# Altium schematic sheet Interface_IO.SchDoc: Access Control
size A3; DrawnBy: Q.Thang & T.Khoa; Revision: V1.0.1; SheetNumber: 16; SheetTotal: 16
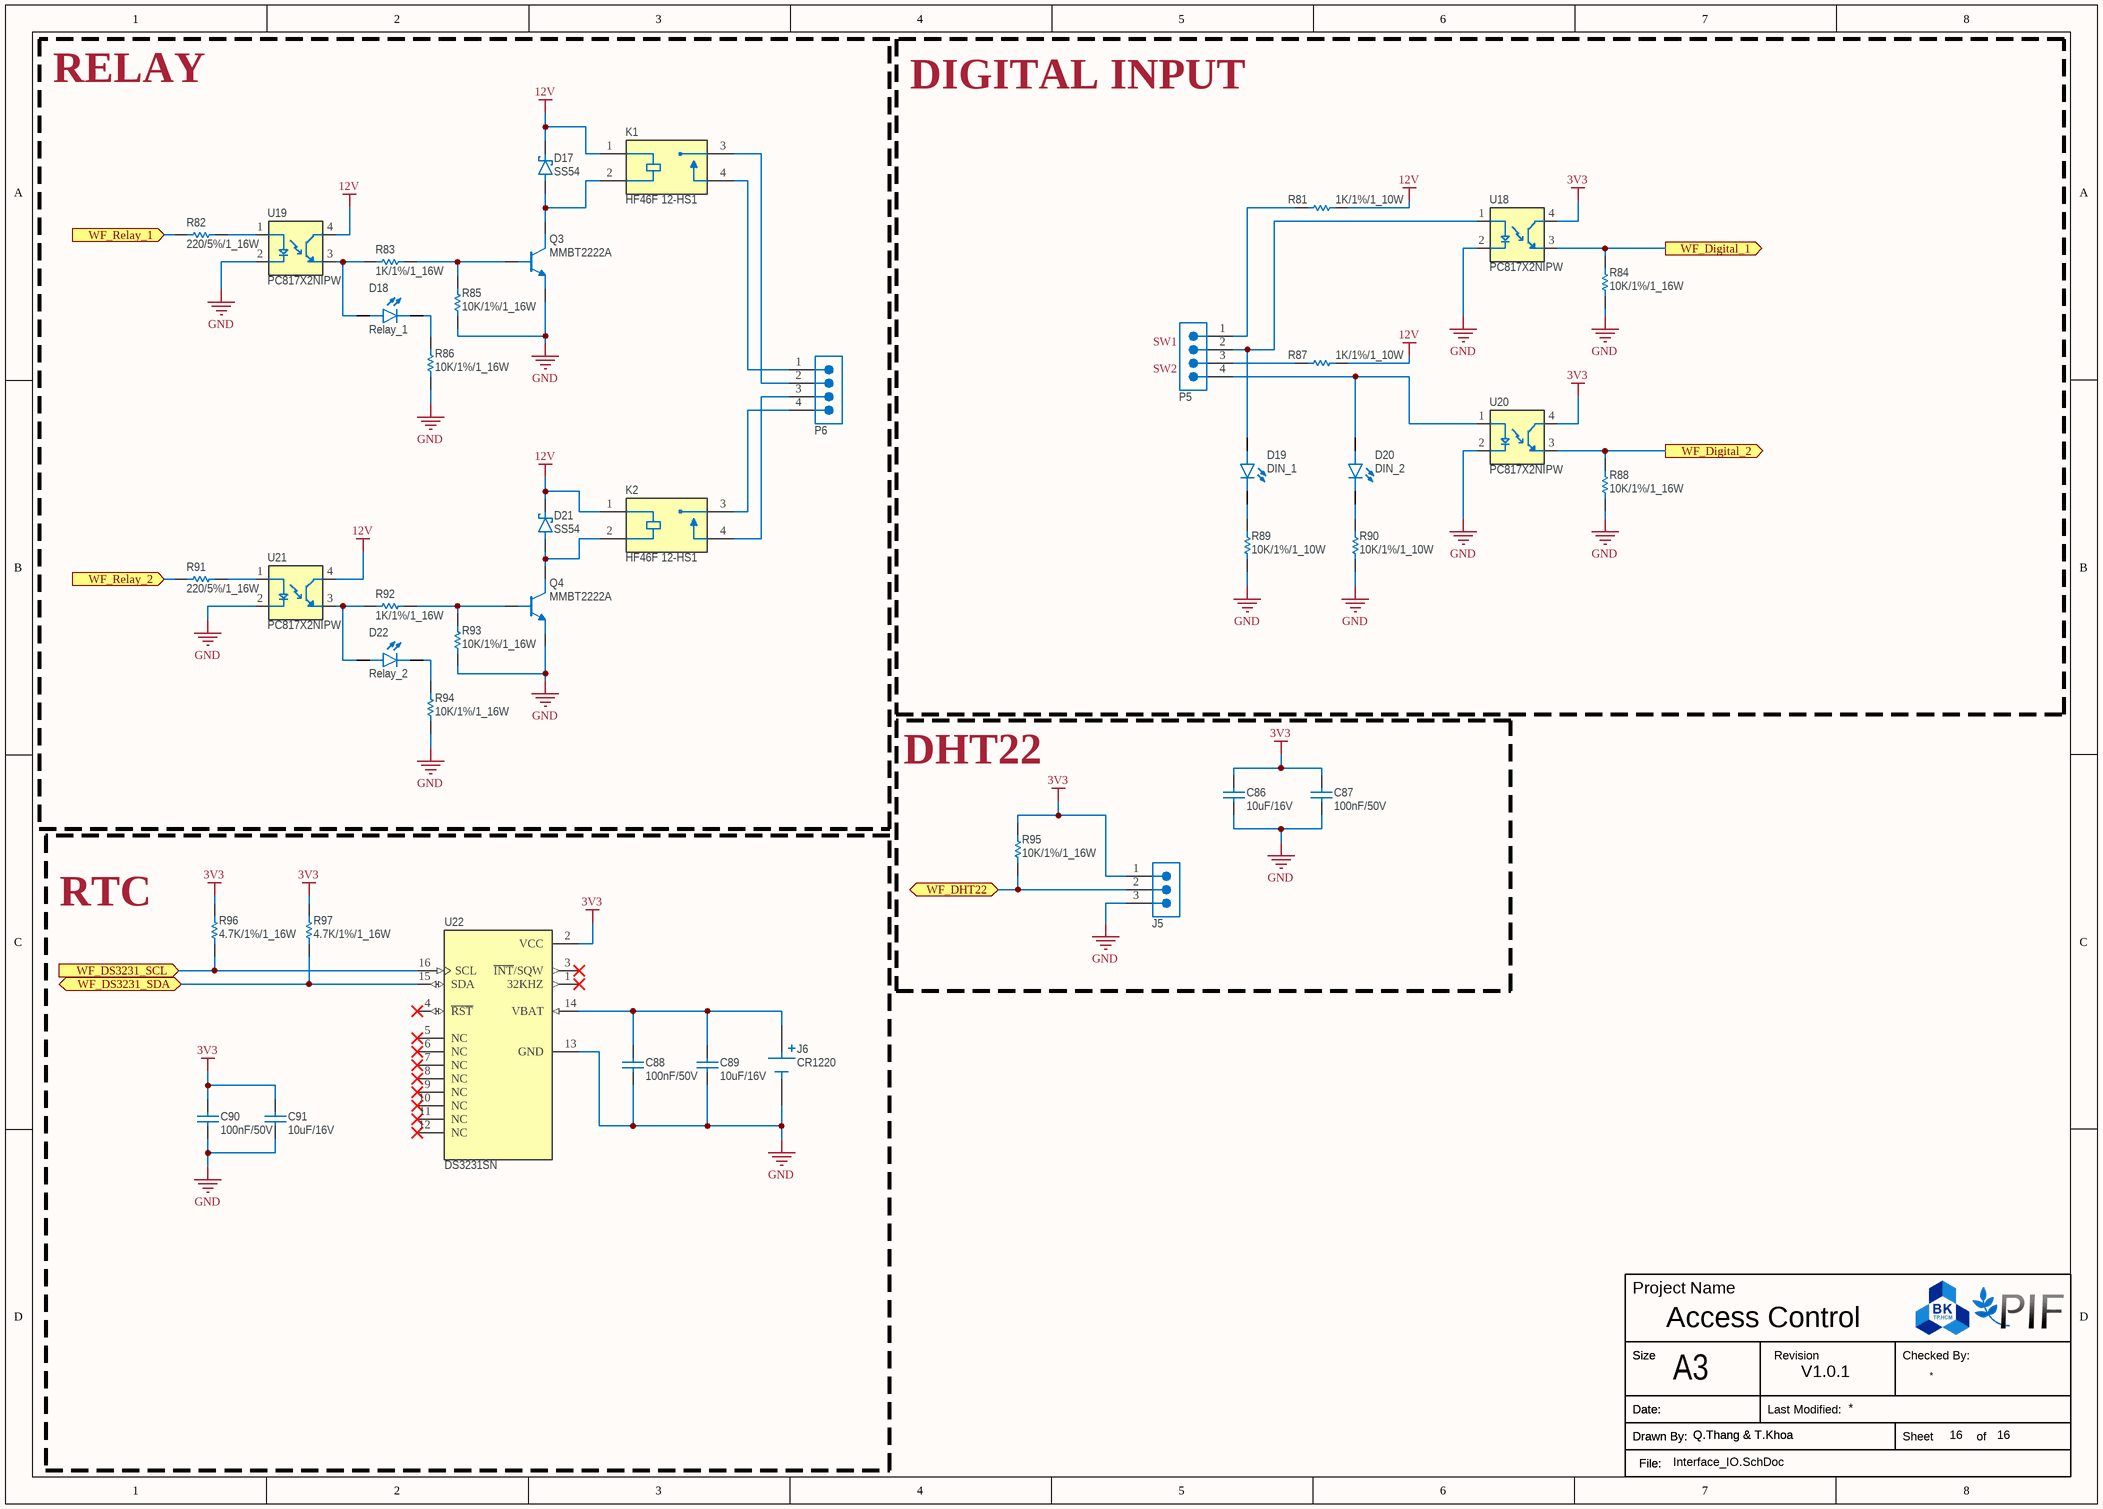
[diagram p0: Interface_IO.SchDoc]

## Parts
C86  10uF/16V  [CAP_0603]
C87  100nF/50V  [CAP_0603]
C88  100nF/50V  [CAP_0603]
C89  10uF/16V  [CAP_0603]
C90  100nF/50V  [CAP_0603]
C91  10uF/16V  [CAP_0603]
D17  SS54  [D_SMA]
D18  Relay_1  [LED_0603Y]
D19  DIN_1  [LED_0603Y]
D20  DIN_2  [LED_0603Y]
D21  SS54  [D_SMA]
D22  Relay_2  [LED_0603Y]
J5  3.81mm_3P  [Terminal_Block_3.81mm_3P]  (value not drawn)
J6  CR1220  [Battery_Holder_CR1220]
K1  HF46F 12-HS1  [RELAY_HF46F_005-HS1]
K2  HF46F 12-HS1  [RELAY_HF46F_005-HS1]
P5  3.81mm_4P  [Terminal_Block_3.81mm_4P]  (value not drawn)
P6  3.81mm_4P  [Terminal_Block_3.81mm_4P]  (value not drawn)
Q3  MMBT2222A  [SOT-23]
Q4  MMBT2222A  [SOT-23]
R81  1K/1%/1_10W  [Resistor_0603]
R82  220/5%/1_16W  [RESISTOR_0402]
R83  1K/1%/1_16W  [RESISTOR_0402]
R84  10K/1%/1_16W  [RESISTOR_0402]
R85  10K/1%/1_16W  [RESISTOR_0402]
R86  10K/1%/1_16W  [RESISTOR_0402]
R87  1K/1%/1_10W  [Resistor_0603]
R88  10K/1%/1_16W  [RESISTOR_0402]
R89  10K/1%/1_10W  [Resistor_0603]
R90  10K/1%/1_10W  [Resistor_0603]
R91  220/5%/1_16W  [RESISTOR_0402]
R92  1K/1%/1_16W  [RESISTOR_0402]
R93  10K/1%/1_16W  [RESISTOR_0402]
R94  10K/1%/1_16W  [RESISTOR_0402]
R95  10K/1%/1_16W  [RESISTOR_0402]
R96  4.7K/1%/1_16W  [RESISTOR_0402]
R97  4.7K/1%/1_16W  [RESISTOR_0402]
U18  PC817X2NIPW  [SOP-4]
U19  PC817X2NIPW  [SOP-4]
U20  PC817X2NIPW  [SOP-4]
U21  PC817X2NIPW  [SOP-4]
U22  DS3231SN  [SOIC-16]

## Blocks framed on the sheet
RELAY: D17 D18 D21 D22 K1 K2 P6 Q3 Q4 R82 R83 R85 R86 R91-R94 U19 U21
DIGITAL INPUT: D19 D20 P5 R81 R84 R87-R90 U18 U20
DHT22: C86 C87 J5 R95
RTC: C88-C91 J6 R96 R97 U22

## Ports
WF_DHT22 (bidir, see Overview_Schematic[6B], ESP32_WiFi[2B]), WF_Digital_1 (out, see Overview_Schematic[6B], ESP32_WiFi[2B]), WF_Digital_2 (out, see Overview_Schematic[6B], ESP32_WiFi[2B]), WF_DS3231_SCL (in, see Overview_Schematic[6B], ESP32_WiFi[3B]), WF_DS3231_SDA (bidir, see Overview_Schematic[6B], ESP32_WiFi[3B]), WF_Relay_1 (in, see Overview_Schematic[6B], ESP32_WiFi[2B]), WF_Relay_2 (in, see Overview_Schematic[6B], ESP32_WiFi[2B])

## Nets
3V3: C86.2 C87.2 C90.2 C91.2 J5.1 R95.2 R96.2 R97.2 U18.4(CT) U20.4(CT) U22.2(VCC)
12V: D17.1(C) D21.1(C) K1.1(COIL1) K2.1(COIL1) R81.1 R87.1 U19.4(CT) U21.4(CT)
GND: C86.1 C87.1 C88.1 C89.1 C90.1 C91.1 J5.3 J6.N(NEG) Q3.2(E) Q4.2(E) R84.1 R85.1 R86.1 R88.1 R89.1 R90.1 R93.1 R94.1 U18.2(C) U19.2(C) U20.2(C) U21.2(C) U22.13(GND)
WF_DHT22: J5.2 R95.1 ; port WF_DHT22
WF_Digital_1: R84.2 U18.3(ET) ; port WF_Digital_1
WF_Digital_2: R88.2 U20.3(ET) ; port WF_Digital_2
WF_DS3231_SCL: R96.1 U22.16(SCL) ; port WF_DS3231_SCL
WF_DS3231_SDA: R97.1 U22.15(SDA) ; port WF_DS3231_SDA
WF_Relay_1: R82.1 ; port WF_Relay_1
WF_Relay_2: R91.1 ; port WF_Relay_2
NetC88_2: C88.2 C89.2 J6.P(POS) U22.14(VBAT)
NetD17_2: D17.2(A) K1.2(COIL2) Q3.3(C)
NetD18_A: D18.A R83.1 U19.3(ET)
NetD18_C: D18.C R86.2
NetD19_A: D19.A P5.2 U18.1(A)
NetD19_C: D19.C R89.2
NetD20_A: D20.A P5.4 U20.1(A)
NetD20_C: D20.C R90.2
NetD21_2: D21.2(A) K2.2(COIL2) Q4.3(C)
NetD22_A: D22.A R92.1 U21.3(ET)
NetD22_C: D22.C R94.2
NetK1_3: K1.3(COM) P6.2
NetK1_4: K1.4(NO) P6.1
NetK2_3: K2.3(COM) P6.4
NetK2_4: K2.4(NO) P6.3
NetP5_1: P5.1 R81.2
NetP5_3: P5.3 R87.2
NetQ3_1: Q3.1(B) R83.2 R85.2
NetQ4_1: Q4.1(B) R92.2 R93.2
NetR82_2: R82.2 U19.1(A)
NetR91_2: R91.2 U21.1(A)

Not connected (* = marked no-connect by the designer): U22 1(32KHZ)* 3(~{INT}/SQW)* 4(~{RST})* 5(NC)* 6(NC)* 7(NC)* 8(NC)* 9(NC)* 10(NC)* 11(NC)* 12(NC)*

## Notes on the sheet
- (near P5) SW1
- (near P5) SW2
- Project Name
- Size
- A3
- Revision
- Checked By:
- Drawn By:
- Date:
- File:
- Last Modified:
- Sheet
- of

## Library data of the parts
C86 C89 C91 = Ceramic_Cap_10uF_16V_0603: CAP, size 0603, 10uF, 16V; Supply Part Number: Tụ Gốm 0603 10uF 16V; Supply Name: Thegioiic; Datasheet: *; Supply URL: https://www.thegioiic.com/tu-gom-0603-10uf-16v
C87 C88 C90 = Ceramic_Cap_100nF_50V_0603: CAP, size 0603, 100nF, 50V; Supply Part Number: Tụ Gốm 0603 100nF (0.1uF) 50V; Supply Name: Thegioiic; Datasheet: *; Supply URL: https://www.thegioiic.com/tu-gom-0603-100nf-0-1uf-50v
D17 D21 = Diode_SS54: Diode Schottky 40V 5A Surface Mount SMA; Supply Part Number: SS54 SMA Diode Shotky 5A 40V; Supply Name: Thegioiic; Datasheet: https://www.thegioiic.com/upload/documents/dc8a63b3eda4738bc390d9dc570a4e18.pdf; Supply URL: https://www.thegioiic.com/ss54-sma-diode-shotky-5a-40v
D18-D20 D22 = LED_Yellow_0603: LED Yellow 0603; Supply Part Number: LED Vàng 0603 Dán SMD Trong Suốt Harvatek; Supply Name: Thegioiic; Supply URL: https://www.thegioiic.com/led-vang-0603-dan-smd-trong-suot-harvatek
J5 = Terminal_Block_3.81mm_3P: Terminal Block THT, pitch 3.81mm, 3p, 300V 10A; Supply Part Number: UL-3.81-3-R Terminal Block Plug-in Hàn PCB 3 Chân Cong 3.81mm 300V 10A ULO; Supply Name: Thegioiic; Datasheet: *; Supply URL: https://www.thegioiic.com/ul-3-81-3-r-terminal-block-plug-in-han-pcb-3-chan-cong-3-81mm-300v-10a-ulo
J6 = Battery_Holder_CR1220: Coin Cell Battery Retainer, Horizontal SMT, for CR1220 Coin Cell Batteries, Tape & Reeled; Supply Part Number: Đế Pin CR1220 Dán SMD; Supply Name: Thegioiic; Datasheet: *; Supply URL: https://www.thegioiic.com/de-pin-cr1220-dan-smd
K1 K2 = HF46F 12-HS1: 4 chân xuyên lỗ; Supply Part Number: HF46F 12-HS1 Rơ Le 12VDC 5A SPST-NO 4 Chân; Supply Name: Thegioiic; Datasheet: https://www.thegioiic.com/upload/documents/1734591411_HF-Xiamen-Hongfa-Electroacoustic-HF46F.pdf; Supply URL: https://www.thegioiic.com/hf46f-12-hs1-ro-le-12vdc-5a-spst-no-4-chan
P5 P6 = Terminal_Block_3.81mm_4P: Terminal Block THT, pitch 3.81mm, 4p, 300V 10A; Supply Part Number: UL-3.81-4-R Terminal Block Plug-in Hàn PCB 4 Chân Cong 3.81mm 300V 10A ULO; Supply Name: Thegioiic; ComponentLink1Description: Website Link; ComponentLink1URL: https://www.we-online.com/redexpert/article/691322310004?ad; ComponentLink2Description: Datasheet Link; ComponentLink2URL: https://www.we-online.com/redexpert/spec/691322310004?ad; Supply URL: https://www.thegioiic.com/ul-3-81-4-r-terminal-block-plug-in-han-pcb-4-chan-cong-3-81mm-300v-10a-ulo
Q3 Q4 = MMBT2222A: Điện áp Vce max: 40V, dòng Ic max: 0.6A, công suất: 0.3W; Supply Part Number: MMBT2222A 1P Transistor NPN 40V 0.6A 3 Chân SOT-23; Supply Name: Thegioiic; Datasheet: https://www.thegioiic.com/upload/documents/1734592311_MMBT2222A.pdf; Supply URL: https://www.thegioiic.com/mmbt2222a-1p-transistor-npn-40v-0-6a-3-chan-sot-23
R81 R87 = Res_1K_0603_1%: Resistor 0603 1KOhm 1% 1_10W; Supply Part Number: Điện Trở 1 KOhm 0603 1%; Supply Name: Thegioiic; Supply URL: https://www.thegioiic.com/dien-tro-1-kohm-0603-1-
R82 R91 = Res_220R_0402_5%: Resistor 0402 220 Ohm 5% 1_16W; Supply Part Number: Điện Trở 220 Ohm 0402 5%; Supply Name: Thegioiic; Supply URL: https://www.thegioiic.com/dien-tro-220-ohm-0402-5-
R83 R92 = Res_1K_0402_1%: Resistor 0402 1KOhm 1% 1_16W; Supply Part Number: Điện Trở 1 KOhm 0402 1%; Supply Name: Thegioiic; Supply URL: https://www.thegioiic.com/dien-tro-1-kohm-0402-1-
R84-R86 R88 R93-R95 = Res_10K_0402_1%: Resistor 0402 10KOhm 1% 1_16W; Supply Part Number: Điện Trở 10 KOhm 0402 1%; Supply Name: Thegioiic; Supply URL: https://www.thegioiic.com/dien-tro-10-kohm-0402-1-
R89 R90 = Res_10K_0603_1%: Resistor 0603 10KOhm 1% 1_10W; Supply Part Number: Điện Trở 10 KOhm 0603 1%; Supply Name: Thegioiic; Supply URL: https://www.thegioiic.com/dien-tro-10-kohm-0603-1-
R96 R97 = Res_4.7K_0402_1%: Resistor 0402 4.7KOhm 1% 1_16W; Supply Part Number: Điện Trở 4.7 KOhm 0402 1%; Supply Name: Thegioiic; Supply URL: https://www.thegioiic.com/dien-tro-4-7-kohm-0402-1-
U18-U21 = PC817X2NIPW: Optocoupler DC-IN 1-CH Transistor DC-OUT 4-Pin; Supply Part Number: PC817X2NIPW Optoisolator Transistor Output 5000Vrms 1 Channel, SOP-4; Supply Name: Thegioiic; Datasheet: https://www.alldatasheet.com/datasheet-pdf/view/525168/SHARP/PC817X2NIP0F.html; Supply URL: https://www.thegioiic.com/pc817x2nipw-optoisolator-transistor-output-5000vrms-1-channel-sop-4
U22 = DS3231SN: Real Time Clock (RTC) IC Clock/Calendar - I²C, 2-Wire Serial 16-SOIC (0.295, 7.50mm Width); Supply Part Number: DS3231SN#T&R IC RTC Clock/Calendar; Supply Name: Thegioiic; Datasheet: https://www.mouser.com/datasheet/2/256/DS3231-102175.pdf; Supply URL: https://www.thegioiic.com/ds3231sn-t-r-ic-rtc-clock-calendar-16-sop